# Altium schematic sheet Power.SchDoc
size A3; Author: ALP Electronics; CompanyName: ALP Electronics; DrawnBy: Caner Alp; Engineer: Caner Alp; Organization: ALP Electronics; Address2: Västerås; Address4: Sweden; SheetNumber: 2; SheetTotal: 3
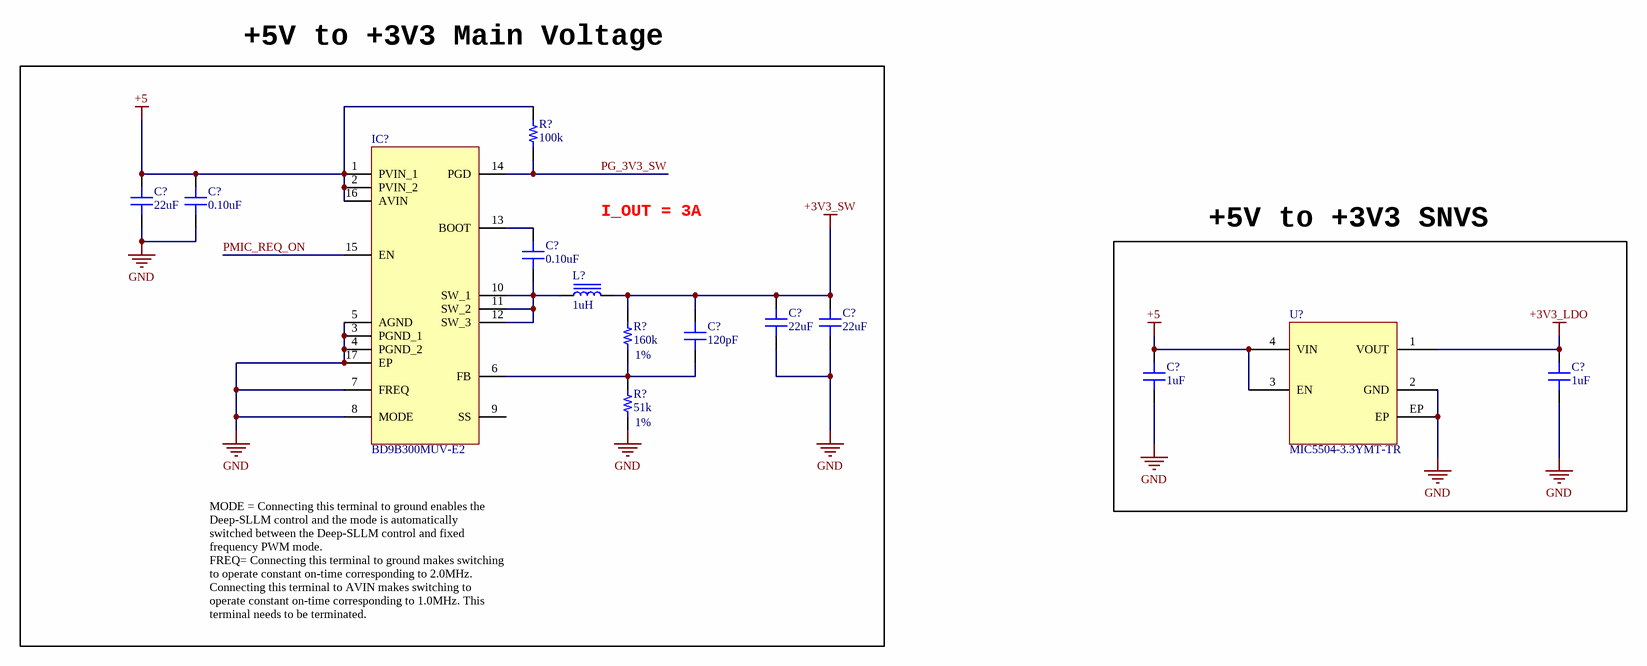
[diagram p0: Power.SchDoc]

## Parts
(Parts that share a designator on the sheet are numbered #1, #2 ... from top to bottom, then left to right.)
C?#1  22uF  [CAP 0805/2012]
C?#2  0.10uF  [CAP 0402/1005]
C?#3  0.10uF  [CAP 0402/1005]
C?#4  22uF  [CAP 0805/2012]
C?#5  22uF  [CAP 0805/2012]
C?#6  120pF  [CAP 0402/1005]
C?#7  1uF  [CAP 0402/1005]
C?#8  1uF  [CAP 0402/1005]
IC?  BD9B300MUV-E2  [QFN50P300X300X100-17N-D]
L?  1uH  [TDK VLS252012HBX-1]
R?#1  100k  [RES 0402/1005]
R?#2  160k  Tolerance: 1%  [RES 0402/1005]
R?#3  51k  Tolerance: 1%  [RES 0402/1005]
U?  MIC5504-3.3YMT-TR  [VREG_MIC5504-3.3YMT-TZ]

## Blocks framed on the sheet
+5V to +3V3 Main Voltage: C?#1-C?#6 IC? L? R?#1-R?#3
+5V to +3V3 SNVS: C?#7 C?#8 U?

## Nets
+3V3_LDO: C?#8.2 U?.1(VOUT)
+3V3_SW: C?#4.2 C?#5.2 C?#6.2 L?.2 R?#2.2
+5: C?#1.2 C?#2.2 C?#7.2 IC?.1(PVIN_1) IC?.2(PVIN_2) IC?.16(AVIN) R?#1.1 U?.3(EN) U?.4(VIN)
GND: C?#1.1 C?#2.1 C?#4.1 C?#5.1 C?#7.1 C?#8.1 IC?.3(PGND_1) IC?.4(PGND_2) IC?.5(AGND) IC?.7(FREQ) IC?.8(MODE) IC?.17(EP) R?#3.1 U?.2(GND) U?.EP
PG_3V3_SW: IC?.14(PGD) R?#1.2
PMIC_REQ_ON: IC?.15(EN)
NetC?#3_1: C?#3.1 IC?.10(SW_1) IC?.11(SW_2) IC?.12(SW_3) L?.1
NetC?#3_2: C?#3.2 IC?.13(BOOT)
NetC?#6_1: C?#6.1 IC?.6(FB) R?#2.1 R?#3.2

Not connected (* = marked no-connect by the designer): IC? 9(SS)

## Notes on the sheet
- I_OUT = 3A
- MODE = Connecting this terminal to ground enables the Deep-SLLM control and the mode is automatically  switched between the Deep-SLLM control and fixed frequency PWM mode.
  FREQ= Connecting this terminal to ground makes switching to operate constant on-time corresponding to 2.0MHz. Connecting this terminal to AVIN makes switching to operate constant on-time corresponding to 1.0MHz. This terminal needs to be terminated.
- Title:
- Size:
- Project:
- A3
- Date:
- Revision:
- Drawn By:
- Sheet
- of

## Library data of the parts
C?#1 C?#4 C?#5 = C2012X5R0J226M125AC: CAP CER 22UF 6.3V X5R 0805; Manufacturer: TDK Corporation; TemperatureRange: -55C ~ 85C; Tolerance: 20%; Value: 22uF; Part Number: C2012X5R0J226M125AC; PartId: 4616; Supplier 1: Digi-Key; Supplier Part Number 1: 445-1422-2-ND; ComponentLink1Description: Datasheet; ComponentLink1URL: https://product.tdk.com/info/en/catalog/datasheets/mlcc_commercial_general_en.pdf; ComponentLink2Description: Digi-Key listing; ComponentLink2URL: http://digikey.com/product-detail/en/C2012X5R0J226M125AC/445-1422-2-ND/569048; TemperatureCoefficient: X5R; Voltage: 6.3V; Price: 0,0861; Type: -; Device Package: 0805 (2012 Metric)
C?#2 C?#3 = LMK105BJ104KV-F: CAP CER 0.1UF 10V X5R 0402; Manufacturer: Taiyo Yuden; TemperatureRange: -55C ~ 85C; Tolerance: 10%; Value: 0.10uF; Part Number: LMK105BJ104KV-F; PartId: 12322; Supplier 1: Digi-Key; Supplier Part Number 1: 587-1227-2-ND; ComponentLink1Description: Datasheet; ComponentLink1URL: http://ds.yuden.co.jp/TYCOMPAS/ut/detail.do?productNo=LMK105BJ104KV-F&fileName=LMK105BJ104KV-F_SS&mode=specSheetDownload; ComponentLink2Description: Digi-Key Listing; ComponentLink2URL: https://www.digikey.com/product-detail/en/taiyo-yuden/LMK105BJ104KV-F/587-1227-2-ND/930579; TemperatureCoefficient: X5R; Voltage: 10V; Price: 0,0021; Device Package: 0402 (1005 Metric)
C?#6 = C1005C0G1H121J050BA: CAP CER 120PF 50V C0G 0402; Manufacturer: TDK Corporation; TemperatureRange: -55C ~ 125C; TemperatureCoefficient: C0G, NP0; Tolerance: 5%; Value: 120pF; Part Number: C1005C0G1H121J050BA; PartId: 3919; Supplier 1: Digi-Key; Supplier Part Number 1: 445-1248-2-ND; ComponentLink1Description: Datasheet; ComponentLink1URL: https://product.tdk.com/info/en/catalog/datasheets/mlcc_commercial_general_en.pdf; ComponentLink2Description: Digi-Key listing; ComponentLink2URL: http://digikey.com/product-detail/en/C1005C0G1H121J050BA/445-1248-2-ND/513669; Voltage: 50V; Price: 0,0075; Type: -; Device Package: 0402 (1005 Metric)
C?#7 C?#8 = GRM155R70J105KA12D: CAP CER 1UF 6.3V X7R 0402; Manufacturer: Murata Electronics North America; TemperatureRange: -55C ~ 125C; Tolerance: 10%; Type: Derating Recommended; Value: 1uF; Part Number: GRM155R70J105KA12D; PartId: 5157; Supplier 1: Digi-Key; Supplier Part Number 1: 490-10024-2-ND; ComponentLink1Description: Datasheet; ComponentLink1URL: http://www.murata.com/~/media/webrenewal/support/library/catalog/products/capacitor/mlcc/c02e.ashx; ComponentLink2Description: Digi-Key listing; ComponentLink2URL: http://digikey.com/product-detail/en/GRM155R70J105KA12D/490-10024-2-ND/5027109; TemperatureCoefficient: X7R; Voltage: 6.3V; Price: 0,019; Device Package: 0402 (1005 Metric)
IC? = BD9B300MUV-E2: Integrated Circuit; Manufacturer_Name: ROHM Semiconductor; Datasheet Link: http://rohmfs.rohm.com/en/products/databook/datasheet/ic/power/switching_regulator/bd9b300muv-e.pdf; Height: 1mm; Manufacturer_Part_Number: BD9B300MUV-E2; Mouser Part Number: 755-BD9B300MUV-E2; Mouser Price/Stock: https://www.mouser.com/Search/Refine.aspx?Keyword=755-BD9B300MUV-E2
L? = VLS252012HBX-1R0M-1: FIXED IND 1UH 3.4A 56 MOHM SMD; Manufacturer: TDK Corporation; Type: Wirewound; Tolerance: 20%; Shielding: Shielded; DC Resistance (DCR): 56 mOhm Max; Value: 1uH; Part Number: VLS252012HBX-1R0M-1; PartId: 9554; Supplier 1: Digi-Key; Supplier Part Number 1: 445-173025-2-ND; ComponentLink1Description: Datasheet; ComponentLink1URL: https://product.tdk.com/info/en/catalog/datasheets/inductor_commercial_power_vls252012hbx-1_en.pdf; ComponentLink2Description: Digi-Key Listing; ComponentLink2URL: https://www.digikey.com/product-detail/en/VLS252012HBX-1R0M-1/445-173025-2-ND/5147063; Price: 0,2815; Device Package: 1008 (2520 Metric); Series: VLS-HBX-1; Inductance: 1uH; Current Rating: 3.4A; Q @ Freq: -; Frequency - Self Resonant: -; Operating Temperature: -40C ~ 105C
R?#1 = ERJ-2GEJ104X: RES SMD 100K OHM 5% 1/10W 0402; Manufacturer: Panasonic Electronic Components; TemperatureRange: -55C ~ 155C; TemperatureCoefficient: 200ppm/C; PowerRating: 0.1W, 1/10W; Value: 100k; Part Number: ERJ-2GEJ104X; PartId: 10985; Supplier 1: Digi-Key; Supplier Part Number 1: P100KJTR-ND; ComponentLink1Description: Datasheet; ComponentLink1URL: http://industrial.panasonic.com/www-cgi/jvcr13pz.cgi?E+PZ+3+AOA0001+ERJ2GEJ104X+7+WW; ComponentLink2Description: Digi-Key Listing; ComponentLink2URL: https://www.digikey.com/product-detail/en/panasonic-electronic-components/ERJ-2GEJ104X/P100KJTR-ND/146731; Tolerance: 5%; Price: 0,0019; Device Package: 0402 (1005 Metric)
R?#2 = ERJ-2RKF1603X: RES SMD 160K OHM 1% 1/10W 0402; Manufacturer: Panasonic Electronic Components; TemperatureRange: -55C ~ 155C; TemperatureCoefficient: 100ppm/C; PowerRating: 0.1W, 1/10W; Value: 160k; Part Number: ERJ-2RKF1603X; PartId: 444; Supplier 1: Digi-Key; Supplier Part Number 1: P160KLTR-ND; ComponentLink1Description: Datasheet; ComponentLink1URL: http://industrial.panasonic.com/www-cgi/jvcr13pz.cgi?E+PZ+3+AOA0002+ERJ2RKF1603X+7+WW; ComponentLink2Description: Digikey listing; ComponentLink2URL: http://digikey.com/product-detail/en/ERJ-2RKF1603X/P160KLTR-ND/1746134; Price: 0,0043; Type: Thick Film; Device Package: 0402 (1005 Metric)
R?#3 = ERJ-2RKF5102X: RES SMD 51K OHM 1% 1/10W 0402; Manufacturer: Panasonic Electronic Components; TemperatureRange: -55C ~ 155C; TemperatureCoefficient: 100ppm/C; PowerRating: 0.1W, 1/10W; Value: 51k; Part Number: ERJ-2RKF5102X; PartId: 166; Supplier 1: Digi-Key; Supplier Part Number 1: P51.0KLTR-ND; ComponentLink1Description: Datasheet; ComponentLink1URL: http://industrial.panasonic.com/www-cgi/jvcr13pz.cgi?E+PZ+3+AOA0002+ERJ2RKF5102X+7+WW; ComponentLink2Description: Digikey listing; ComponentLink2URL: http://digikey.com/product-detail/en/ERJ-2RKF5102X/P51.0KLTR-ND/1647131; Price: 0,0043; Type: Thick Film; Device Package: 0402 (1005 Metric)
U? = MIC5504-3.3YMT-TR: 300mA LDO